# Altium schematic sheet LTC6820.SchDoc
size A4; SheetNumber: 5; SheetTotal: 5
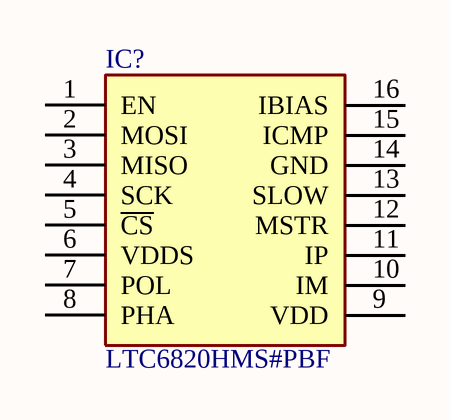
[diagram p0: LTC6820.SchDoc]

## Parts
IC?  LTC6820HMS#PBF  [SOP50P490X110-16N]

## Nets

Not connected (* = marked no-connect by the designer): IC? 1(EN) 2(MOSI) 3(MISO) 4(SCK) 5(~{CS}) 6(VDDS) 7(POL) 8(PHA) 9(VDD) 10(IM) 11(IP) 12(MSTR) 13(SLOW) 14(GND) 15(ICMP) 16(IBIAS)

## Library data of the parts
IC? = LTC6820HMS#PBF: Integrated Circuit; Manufacturer_Name: Analog Devices; Datasheet Link: https://www.analog.com/media/en/technical-documentation/data-sheets/LTC6820.pdf; Height: 1.1mm; Manufacturer_Part_Number: LTC6820HMS#PBF; Mouser Part Number: 584-LTC6820HMS#PBF; Mouser Price/Stock: https://www.mouser.co.uk/ProductDetail/Analog-Devices/LTC6820HMSPBF?qs=hVkxg5c3xu%252BAhS55eUb%252BEQ%3D%3D; Arrow Part Number: LTC6820HMS#PBF; Arrow Price/Stock: https://www.arrow.com/en/products/ltc6820hmspbf/analog-devices?region=nac